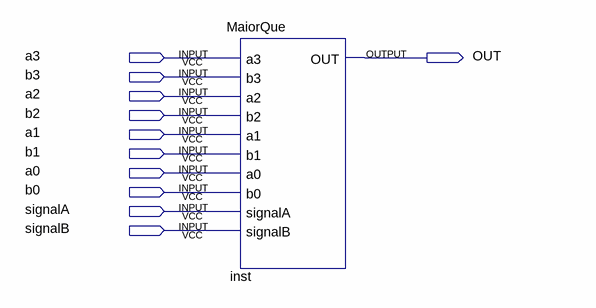
[diagram p0: schematic sheet]
// Quartus schematic AmaiorqB.bdf as structural Verilog: 1 symbols, 11 pins
module AmaiorqB (
  input  a3,
  input  b3,
  input  a2,
  input  b2,
  input  a1,
  input  b1,
  input  a0,
  input  b0,
  input  signalA,
  input  signalB,
  output OUT
);

  MaiorQue inst (
    .a3(a3), .b3(b3), .a2(a2), .b2(b2), .a1(a1), .b1(b1), .a0(a0), .b0(b0), .signalA(signalA),
    .signalB(signalB), .OUT(OUT));
endmodule
